# Altium schematic sheet Low Distortion Oscillator.Amp.SchDoc
size A4
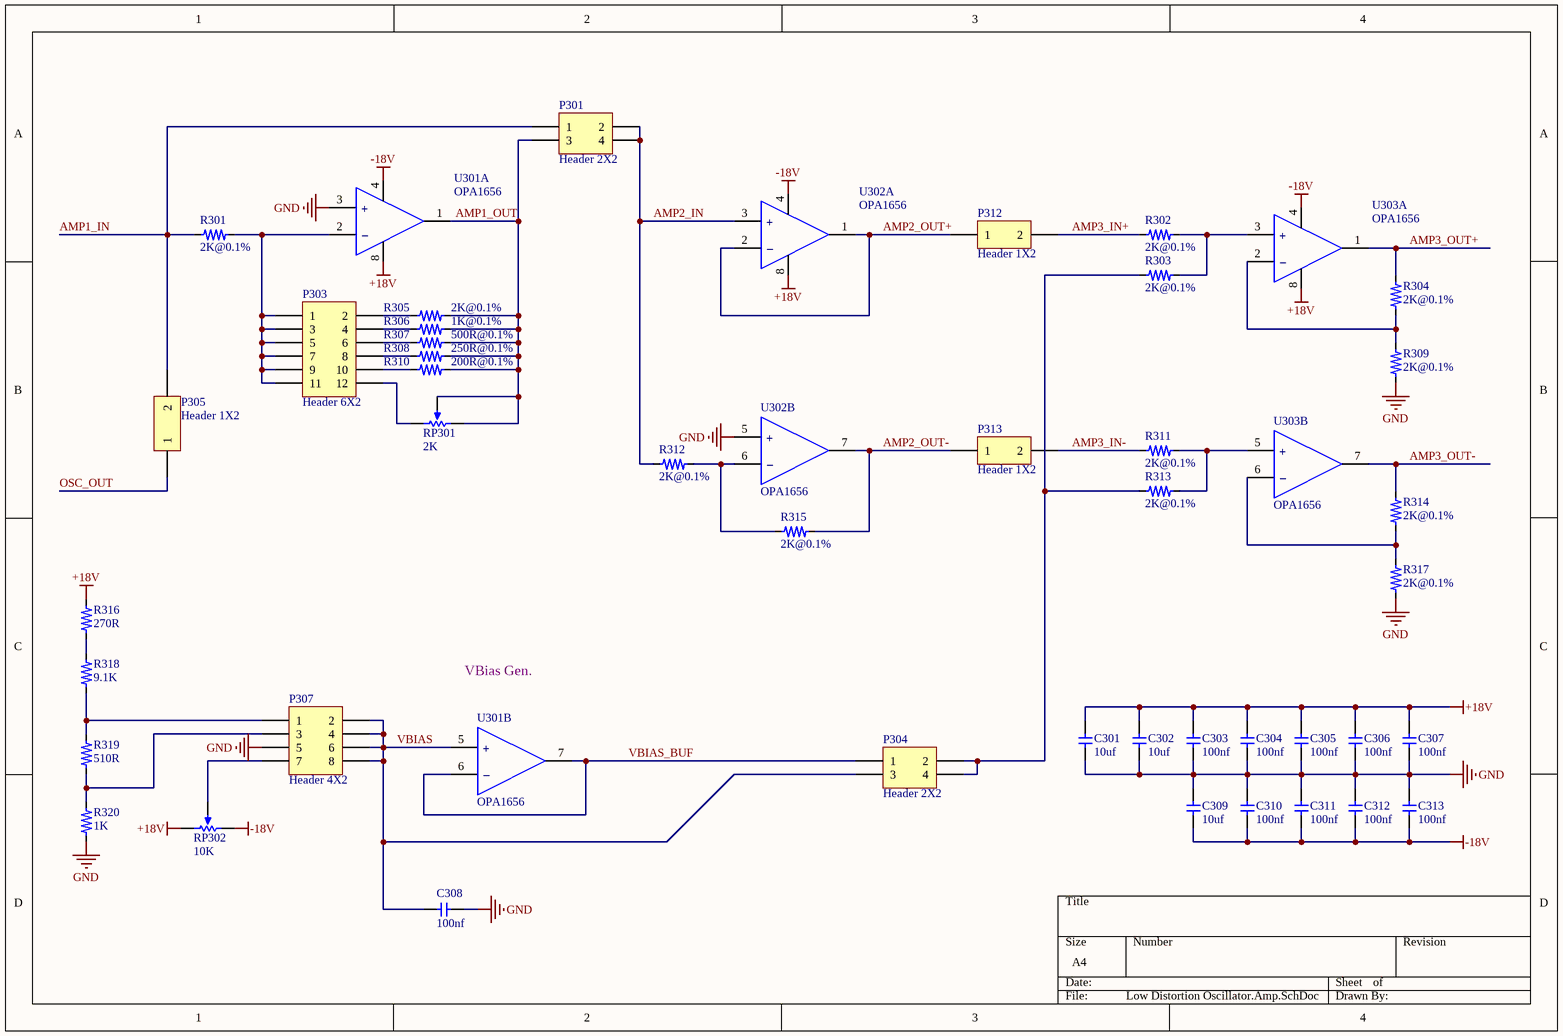
[diagram p0: Low Distortion Oscillator.Amp.SchDoc]

## Parts
C301  value 10uf  [C1206]  (hidden comment: Cap)
C302  value 10uf  [C1206]  (hidden comment: Cap)
C303  value 100nf  [C0805]  (hidden comment: Cap)
C304  value 100nf  [C0805]  (hidden comment: Cap)
C305  value 100nf  [C0805]  (hidden comment: Cap)
C306  value 100nf  [C0805]  (hidden comment: Cap)
C307  value 100nf  [C0805]  (hidden comment: Cap)
C308  value 100nf  [C0805]  (hidden comment: Cap)
C309  value 10uf  [C1206]  (hidden comment: Cap)
C310  value 100nf  [C0805]  (hidden comment: Cap)
C311  value 100nf  [C0805]  (hidden comment: Cap)
C312  value 100nf  [C0805]  (hidden comment: Cap)
C313  value 100nf  [C0805]  (hidden comment: Cap)
P301  Header 2X2  [HDR2X2]
P303  Header 6X2  [HDR2X6]
P304  Header 2X2  [HDR2X2]
P305  Header 1X2  [HDR2X1]
P307  Header 4X2  [HDR2X4]
P312  Header 1X2  [HDR2X1]
P313  Header 1X2  [HDR2X1]
R301  value 2K@0.1%  [R0805]  (hidden comment: Res)
R302  value 2K@0.1%  [R0805]  (hidden comment: Res)
R303  value 2K@0.1%  [R0805]  (hidden comment: Res)
R304  value 2K@0.1%  [R0805]  (hidden comment: Res)
R305  value 2K@0.1%  [R0805]  (hidden comment: Res)
R306  value 1K@0.1%  [R0805]  (hidden comment: Res)
R307  value 500R@0.1%  [R0805]  (hidden comment: Res)
R308  value 250R@0.1%  [R0805]  (hidden comment: Res)
R309  value 2K@0.1%  [R0805]  (hidden comment: Res)
R310  value 200R@0.1%  [R0805]  (hidden comment: Res)
R311  value 2K@0.1%  [R0805]  (hidden comment: Res)
R312  value 2K@0.1%  [R0805]  (hidden comment: Res)
R313  value 2K@0.1%  [R0805]  (hidden comment: Res)
R314  value 2K@0.1%  [R0805]  (hidden comment: Res)
R315  value 2K@0.1%  [R0805]  (hidden comment: Res)
R316  value 270R  [R0805]  (hidden comment: Res)
R317  value 2K@0.1%  [R0805]  (hidden comment: Res)
R318  value 9.1K  [R0805]  (hidden comment: Res)
R319  value 510R  [R0805]  (hidden comment: Res)
R320  value 1K  [R0805]  (hidden comment: Res)
RP301  value 2K  [RP-3590S-2]  (hidden comment: Res Pot)
RP302  value 10K  [RP-3590S-2]  (hidden comment: Res Pot)
U301  OPA1656  [OPAMP-SOIC8]  (parts A,B of 2)
U302  OPA1656  [OPAMP-SOIC8]  (parts A,B of 2)
U303  OPA1656  [OPAMP-SOIC8]  (parts A,B of 2)

## Nets
+18V: C301.2 C302.2 C303.2 C304.2 C305.2 C306.2 C307.2 R316.2 RP302.3(BOT) U301.8(+Vs) U302.8(+Vs) U303.8(+Vs)
-18V: C309.1 C310.1 C311.1 C312.1 C313.1 RP302.1(TOP) U301.4(-Vs) U302.4(-Vs) U303.4(-Vs)
GND: C301.1 C302.1 C303.1 C304.1 C305.1 C306.1 C307.1 C308.1 C309.2 C310.2 C311.2 C312.2 C313.2 P307.5 R309.2 R317.2 R320.1 U301.3(+IN_A) U302.5(+IN_B)
AMP1_IN: P301.1 P305.2 R301.2
AMP1_OUT: P301.3 R305.1 R306.1 R307.1 R308.1 R310.1 RP301.1(TOP) RP301.2(TAP) U301.1(OUT_A)
AMP2_IN: P301.2 P301.4 R312.2 U302.3(+IN_A)
AMP2_OUT+: P312.1 U302.1(OUT_A) U302.2(-IN_A)
AMP2_OUT-: P313.1 R315.1 U302.7(OUT_B)
AMP3_IN+: P312.2 R302.2
AMP3_IN-: P313.2 R311.2
AMP3_OUT+: R304.1 U303.1(OUT_A)
AMP3_OUT-: R314.1 U303.7(OUT_B)
OSC_OUT: P305.1
VBIAS: C308.2 P304.3 P307.2 P307.4 P307.6 P307.8 U301.5(+IN_B)
VBIAS_BUF: P304.1 U301.6(-IN_B) U301.7(OUT_B)
NetP303_1: P303.1 P303.3 P303.5 P303.7 P303.9 P303.11 R301.1 U301.2(-IN_A)
NetP303_2: P303.2 R305.2
NetP303_4: P303.4 R306.2
NetP303_6: P303.6 R307.2
NetP303_8: P303.8 R308.2
NetP303_10: P303.10 R310.2
NetP303_12: P303.12 RP301.3(BOT)
NetP304_2: P304.2 P304.4 R303.2 R313.2
NetP307_1: P307.1 R318.1 R319.2
NetP307_3: P307.3 R319.1 R320.2
NetP307_7: P307.7 RP302.2(TAP)
NetR302_1: R302.1 R303.1 U303.3(+IN_A)
NetR304_2: R304.2 R309.1 U303.2(-IN_A)
NetR311_1: R311.1 R313.1 U303.5(+IN_B)
NetR312_1: R312.1 R315.2 U302.6(-IN_B)
NetR314_2: R314.2 R317.1 U303.6(-IN_B)
NetR316_1: R316.1 R318.2

## Notes on the sheet
- VBias Gen.
- (in symbol OP AMP 2#, part A) +; –
- (in symbol OP AMP 2#, part B) +; –

## Library data of the parts
P301 P304 = Header 2X2: Header, 2-Pin, Dual row
P303 = Header 6X2: Header, 6-Pin, Dual row
P305 P312 P313 = Header 1X2: Header, 1-Pin, Dual row
P307 = Header 4X2: Header, 4-Pin, Dual row
R301-R320 = Res: 电阻
RP301 RP302 = Res Pot: 电位器
U301-U303 = OP AMP 2#: Universal Operational Amplifiers.